# Altium schematic sheet ESP32DISPLAY.SchDoc
size 381 x 228 mm
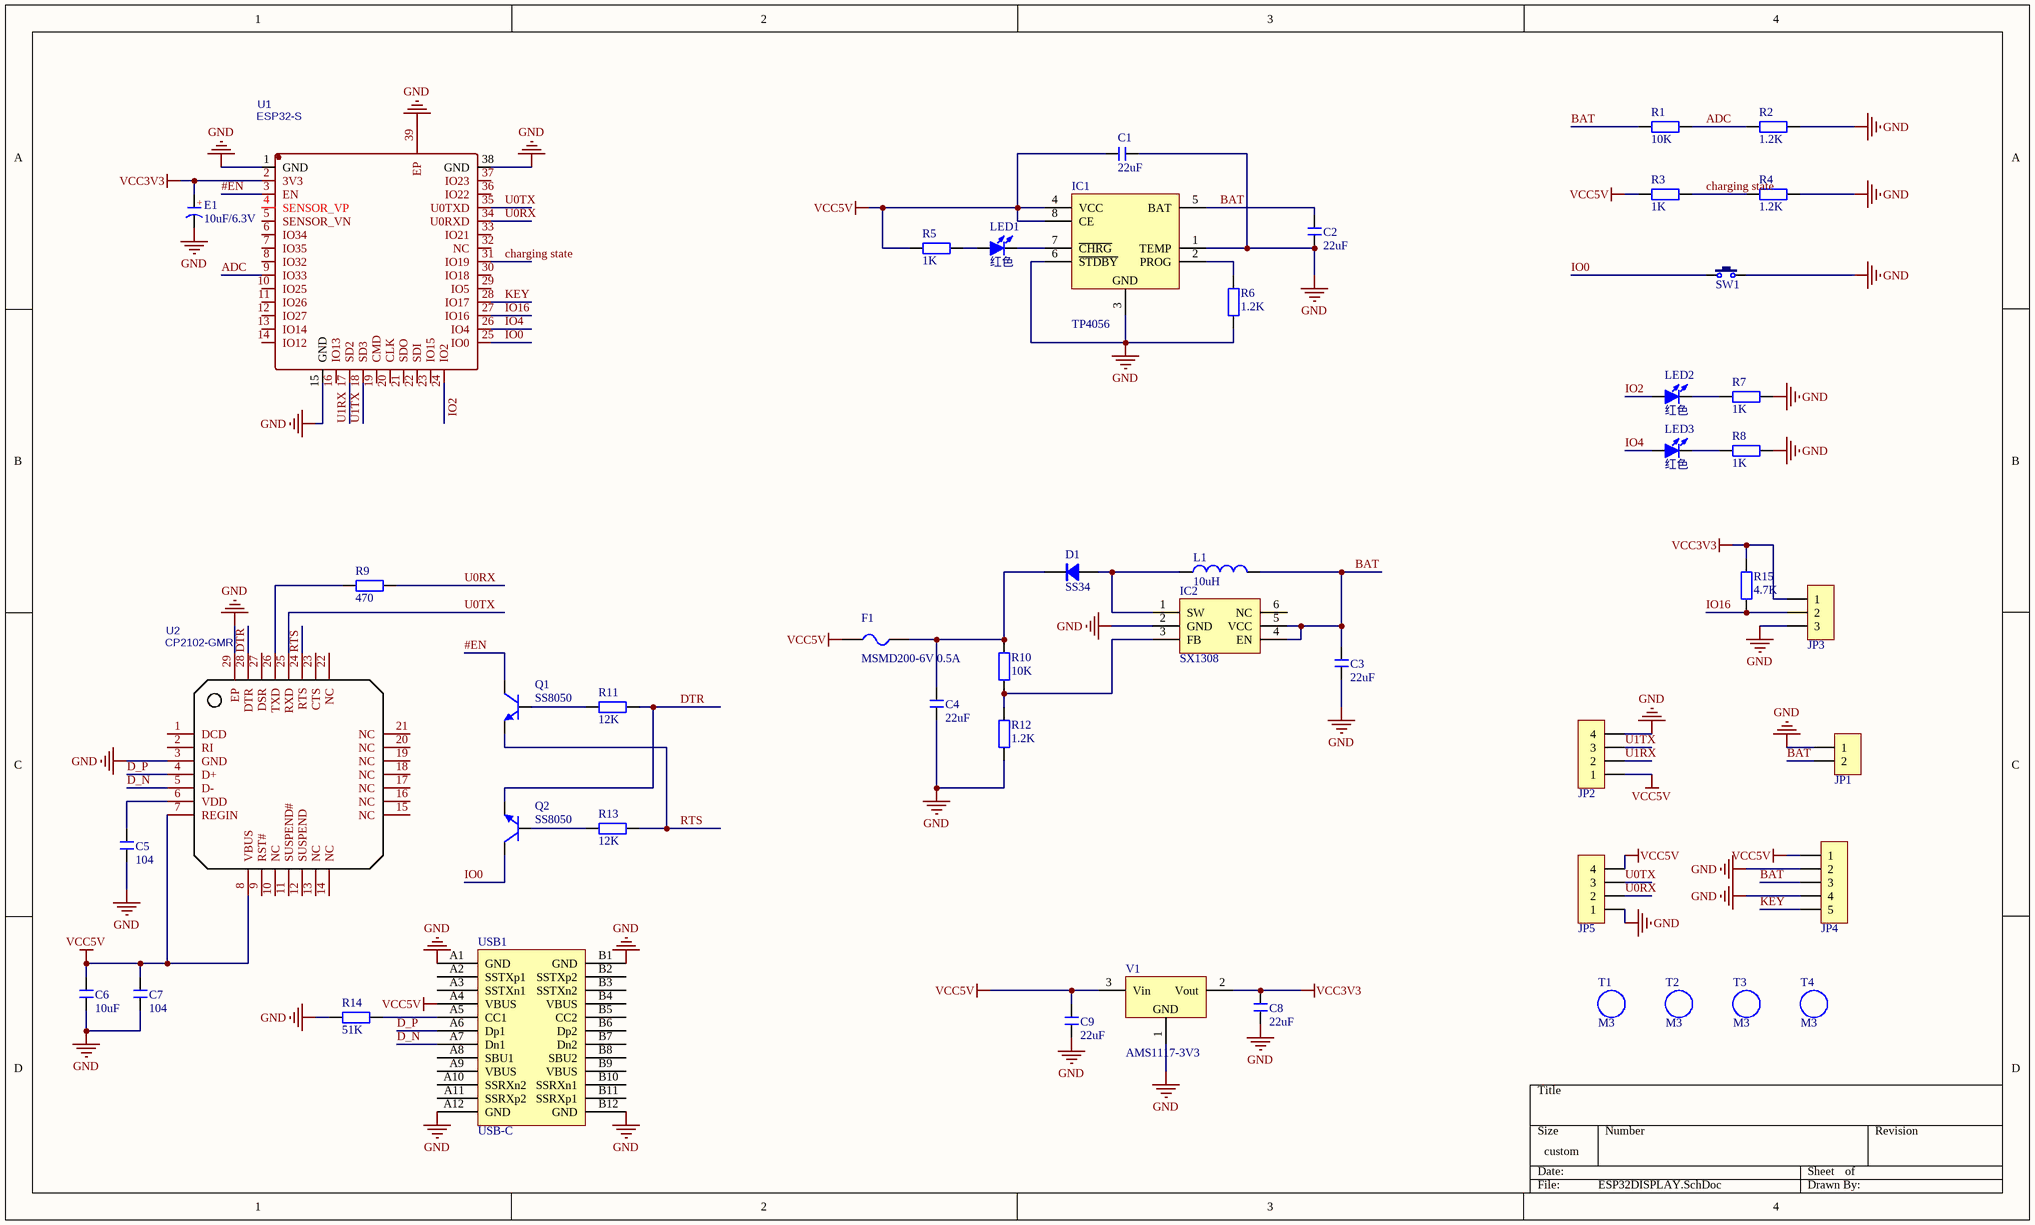
[diagram p0: ESP32DISPLAY.SchDoc]

## Parts
C1  22uF  [C 0805_L]
C2  22uF  [C 0805_L]
C3  22uF  [C 0805_L]
C4  22uF  [C 0805_L]
C5  104  [C 0603_L]
C6  10uF  [C 1206_L]
C7  104  [C 0805_L]
C8  22uF  [C 1206_L]
C9  22uF  [C 1206_L]
D1  SS34  [SMC]
E1  10uF/6.3V  [CD B(3528)]
F1  MSMD200-6V 0.5A  [FU 1206]
IC1  TP4056  [SOP8_N]
IC2  SX1308  [SOT23-6N]
JP1  HDR-1X2  [XH2.54-WI-2P]  (value not drawn)
JP2  HDR-1X4  [XH2.54-WI-4P]  (value not drawn)
JP3  HDR-1X3  [XH2.54-WI-3P]  (value not drawn)
JP4  HDR-1X5  [HDR2.54-LI-5P]  (value not drawn)
JP5  HDR-1X4  [HDR2.54-LI-4P]  (value not drawn)
L1  10uH  [SMD,6.6x7.1x3.0mm]
LED1  红色  [LED 0603R]
LED2  红色  [LED 0603R]
LED3  红色  [LED 0603R]
Q1  SS8050  [SOT23-3N]
Q2  SS8050  [SOT23-3N]
R1  10K  [R 0603_L]
R2  1.2K  [R 0603_L]
R3  1K  [R 0603_L]
R4  1.2K  [R 0603_L]
R5  1K  [R 0603_L]
R6  1.2K  [R 0603_L]
R7  1K  [R 0603_L]
R8  1K  [R 0603_L]
R9  470  [R 0603_L]
R10  10K  [R 0603_L]
R11  12K  [R 0603_L]
R12  1.2K  [R 0603_L]
R13  12K  [R 0603_L]
R14  51K  [R 0603_L]
R15  4.7K  [R 0603_L]
SW1  3x6x5  [TSW SMD-3*6*2.5]  (value not drawn)
T1  M3  [M3 125X200]
T2  M3  [M3 125X200]
T3  M3  [M3 125X200]
T4  M3  [M3 125X200]
U1  ESP32-S  [ESP32-S]
U2  CP2102-GMR  [CP2102]
USB1  USB-C  [USB-C/S_A]
V1  AMS1117-3V3  [SOT223_N]

## Nets
GND: C1.1 C2.1 C3.1 C4.1 C5.1 C6.1 C7.1 C8.1 C9.1 E1.2(K) IC1.1(TEMP) IC1.3(GND) IC1.6(~{STDBY}) IC2.2(GND) JP1.1 JP2.4 JP3.3 JP4.2 JP4.4 JP5.1 R2.2 R4.2 R6.1 R7.2 R8.2 R12.1 R14.2 SW1.2 U1.1(GND) U1.15(GND) U1.38(GND) U1.39(EP) U2.3(GND) U2.29(EP) USB1.A1(GND) USB1.A12(GND) USB1.B1(GND) USB1.B12(GND) V1.1(GND)
VCC3V3: C8.2 E1.1(A) JP3.1 R15.2 U1.2(3V3) V1.2(Vout)
VCC5V: C1.2 C6.2 C7.2 C9.2 F1.1 IC1.4(VCC) IC1.8(CE) JP2.1 JP4.1 JP5.4 R3.1 R5.1 U2.7(REGIN) U2.8(VBUS) USB1.A4(VBUS) V1.3(Vin)
#EN: Q1.3(C) U1.3(EN)
ADC: R1.2 R2.1 U1.9(IO33)
BAT: C2.2 C3.2 IC1.5(BAT) IC2.4(EN) IC2.5(VCC) JP1.2 JP4.3 L1.2 R1.1
charging state: R3.2 R4.1 U1.31(IO19)
D_N: U2.5(D-) USB1.A7(Dn1)
D_P: U2.4(D+) USB1.A6(Dp1)
DTR: Q2.2(E) R11.2 U2.28(DTR)
IO0: Q2.3(C) SW1.1 U1.25(IO0)
IO2: LED2.1(A) U1.24(IO2)
IO4: LED3.1(A) U1.26(IO4)
IO16: JP3.2 R15.1 U1.27(IO16)
KEY: JP4.5 U1.28(IO17)
RTS: Q1.2(E) R13.2 U2.24(RTS)
U0RX: JP5.2 R9.2 U1.34(U0RXD)
U0TX: JP5.3 U1.35(U0TXD) U2.25(RXD)
U1RX: JP2.2 U1.17(SD2)
U1TX: JP2.3 U1.18(SD3)
NetC4_2: C4.2 D1.2(K) F1.2 R10.2
NetC5_2: C5.2 U2.6(VDD)
NetD1_1: D1.1(A) IC2.1(SW) L1.1
NetIC1_2: IC1.2(PROG) R6.2
NetIC1_7: IC1.7(~{CHRG}) LED1.2(K)
NetIC2_3: IC2.3(FB) R10.1 R12.2
NetLED1_1: LED1.1(A) R5.2
NetLED2_2: LED2.2(K) R7.1
NetLED3_2: LED3.2(K) R8.1
NetQ1_1: Q1.1(B) R11.1
NetQ2_1: Q2.1(B) R13.1
NetR9_1: R9.1 U2.26(TXD)
NetR14_1: R14.1 USB1.A5(CC1)

Not connected (* = marked no-connect by the designer): IC2 6(NC); U1 4(SENSOR_VP) 5(SENSOR_VN) 6(IO34) 7(IO35) 8(IO32) 10(IO25) 11(IO26) 12(IO27) 13(IO14) 14(IO12) 16(IO13) 19(CMD) 20(CLK) 21(SDO) 22(SDI) 23(IO15) 29(IO5) 30(IO18) 32(NC) 33(IO21) 36(IO22) 37(IO23); U2 1(DCD) 2(RI) 9(RST#) 10(NC) 11(SUSPEND#) 12(SUSPEND) 13(NC) 14(NC) 15(NC) 16(NC) 17(NC) 18(NC) 19(NC) 20(NC) 21(NC) 22(NC) 23(CTS) 27(DSR); USB1 A2(SSTXp1) A3(SSTXn1) A8(SBU1) A9(VBUS) A10(SSRXn2) A11(SSRXp2) B2(SSTXp2) B3(SSTXn2) B4(VBUS) B5(CC2) B6(Dp2) B7(Dn2) B8(SBU2) B9(VBUS) B10(SSRXn1) B11(SSRXp1)

## Notes on the sheet
- (in symbol C-CD) +

## Library data of the parts
C1-C9 = C: 无极性贴片电容; 版权归属: 源创客; 材质: X7R; BOM名称: 无极性贴片电容; 学习资源: www.ooocke.com
D1 = SS34: 肖特基二极管; 版权归属: 源创客; 属性: 40V/3A; BOM名称: 肖特基二极管; 学习资源: www.ooocke.com
E1 = C-CD: 贴片钽电容; 版权归属: 源创客; BOM名称: 贴片钽电容; 学习资源: www.ooocke.com
F1 = FU: 贴片保险丝; 版权归属: 源创客; BOM名称: 贴片保险丝; 学习资源: www.ooocke.com
IC1 = TP4056: 锂电池充电管理; 版权归属: 源创客; BOM名称: 锂电池充电管理; 学习资源: www.ooocke.com
IC2 = SX1308: 可调升压芯片; 版权归属: 源创客; BOM名称: 可调升压芯片; 学习资源: www.ooocke.com
JP1 = Header 2: 2P接插件; 版权归属: 源创客; BOM名称: 2P接插件; 学习资源: www.ooocke.com
JP2 JP5 = Header 4: 4P接插件; 版权归属: 源创客; BOM名称: 4P接插件; 学习资源: www.ooocke.com
JP3 = Header 3: 3P接插件; 版权归属: 源创客; BOM名称: 3P接插件; 学习资源: www.ooocke.com
JP4 = Header 5: 5P接插件; 版权归属: 源创客; BOM名称: 5P接插件; 学习资源: www.ooocke.com
L1 = L: 小功率贴片电感; 版权归属: 源创客; BOM名称: 小功率贴片电感; 学习资源: www.ooocke.com
LED1-LED3 = LED-SMD: 贴片LED; 版权归属: 源创客; BOM名称: 贴片LED; 学习资源: www.ooocke.com
Q1 Q2 = 8050-SMD: 高频放大-NPN型; 版权归属: 源创客; 属性: 40V 1.5A 1W 100MHZ; BOM名称: 高频放大-NPN型; 学习资源: www.ooocke.com
R1-R15 = R: 贴片电阻; 版权归属: 源创客; BOM名称: 贴片电阻; 学习资源: www.ooocke.com
SW1 = TSW 3x6: 3x6轻触开关; 版权归属: 源创客; BOM名称: 3x6轻触开关; 学习资源: www.ooocke.com
T1-T4 = M3: 铜柱孔; 版权归属: 源创客; BOM名称: 铜柱孔; 学习资源: www.ooocke.com
U1 = ESP32-S: BOM_Manufacturer: Ai-Thinker; Contributor: LCSC; BOM_Paste Type: expand; BOM_Supplier: LCSC; BOM_Supplier Part: C277944; BOM_Manufacturer Part: ESP32-S; spicePre: U; spiceSymbolName: ESP32-S
U2 = CP2102-GMR: BOM_Manufacturer: SILICON LABS; BOM_Paste Type: base; BOM_Supplier: LCSC; BOM_Manufacturer Part: CP2102-GMR; image: //image.lceda.cn/szlcsc/C6568.jpg; BOM_Supplier Part: C6568; spicePre: U; spiceSymbolName: CP2102-GMR
USB1 = USB-C/S: USB-C型母接口; 版权归属: 源创客; BOM名称: USB-C型母接口; 学习资源: www.ooocke.com
V1 = AMS1117: 三端稳压芯片; BOM名称: 稳压芯片; 版权归属: 源创客; 学习资源: www.ooocke.com